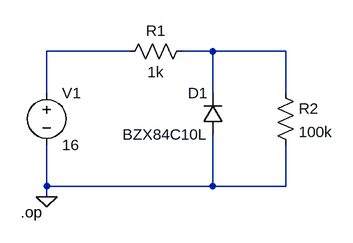
[diagram p0: schematic Assignment 3-4.asc]
Assignment 3-4.asc, the LTspice schematic file:
Version 4.1
SHEET 1 880 680
WIRE 192 80 64 80
WIRE 320 80 272 80
WIRE 432 80 320 80
WIRE 64 144 64 80
WIRE 320 144 320 80
WIRE 432 144 432 80
WIRE 64 288 64 224
WIRE 320 288 320 208
WIRE 320 288 64 288
WIRE 432 288 432 224
WIRE 432 288 320 288
WIRE 64 304 64 288
FLAG 64 304 0
DATAFLAG 320 80 ""
DATAFLAG 64 80 ""
SYMBOL voltage 64 128 R0
WINDOW 123 0 0 Left 0
WINDOW 39 0 0 Left 0
SYMATTR InstName V1
SYMATTR Value 16
SYMBOL res 288 64 R90
WINDOW 0 0 56 VBottom 2
WINDOW 3 32 56 VTop 2
SYMATTR InstName R1
SYMATTR Value 1k
SYMBOL diode 336 208 R180
WINDOW 0 24 64 Left 2
WINDOW 3 24 0 Left 2
SYMATTR InstName D1
SYMATTR Value BZX84C10L
SYMATTR Description Diode
SYMATTR Type diode
SYMBOL res 416 128 R0
SYMATTR InstName R2
SYMATTR Value 100k
TEXT 24 328 Left 2 !.op

The netlist it stands for:
* Assignment 3-4.asc
V1 N001 0 16
R1 N002 N001 1k
D1 0 N002 BZX84C10L
R2 N002 0 100k
.model D D
.lib standard.dio
.op
.backanno
.end